# Altium project OPID[188] Backplane.PrjPcb
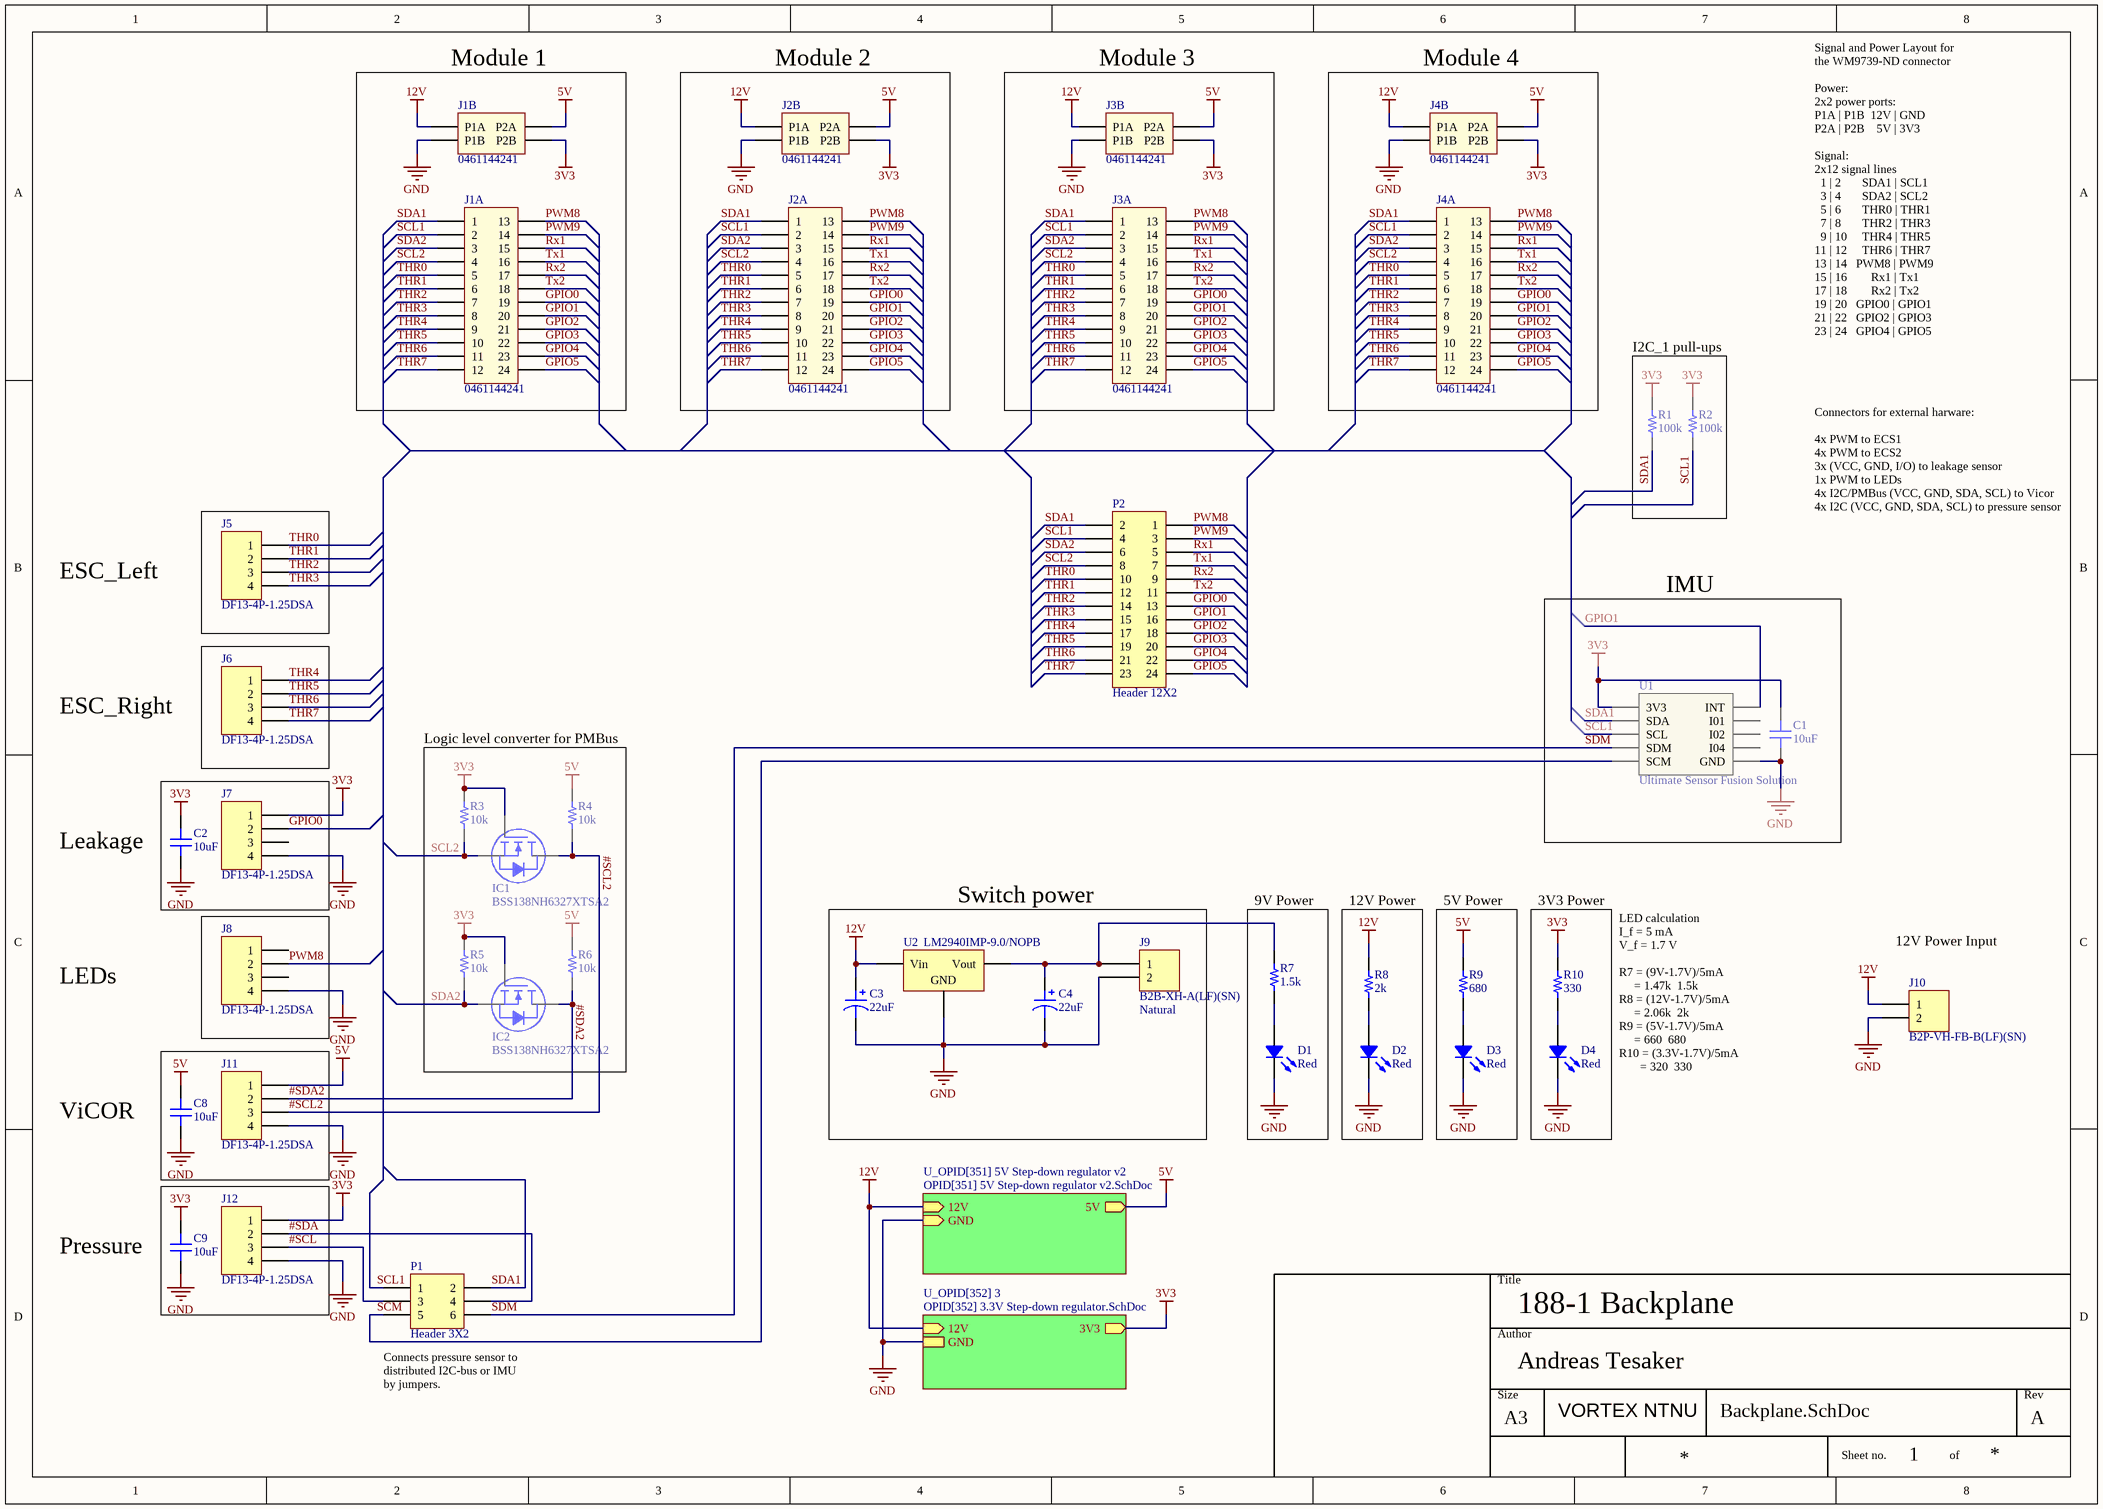
[diagram p0: Backplane.SchDoc]
3 sheets, 65 parts. Net scope: hierarchical (ports join the sheet entries above them; power ports are global).
Board file: Backplane_PCB_v2.PcbDoc
Sheets:
  Backplane.SchDoc
    U_OPID[352] 3 = OPID[352] 3.3V Step-down regulator.SchDoc
    U_OPID[351] 5V Step-down regulator v2 = OPID[351] 5V Step-down regulator v2.SchDoc

## Sheet Backplane.SchDoc: 188-1 Backplane
size A3; Author: Andreas Tesaker; CompanyName: VORTEX NTNU; Revision: A; SheetNumber: 1

### Parts
C1  10uF  [CAP 1210/3225 - 2.8MM]
C2  10uF  [CAP 1210/3225 - 2.8MM]
C3  22uF  [CAP ALUM 6.6MM]
C4  22uF  [CAP POL 2917/7343]
C8  10uF  [CAP 1210/3225 - 2.8MM]
C9  10uF  [CAP 1210/3225 - 2.8MM]
D1  Red  [LED 0805/2012 RED]
D2  Red  [LED 0805/2012 RED]
D3  Red  [LED 0805/2012 RED]
D4  Red  [LED 0805/2012 RED]
IC1  BSS138NH6327XTSA2  [INFINEON SOT-23-3]
IC2  BSS138NH6327XTSA2  [INFINEON SOT-23-3]
J1  0461144241  [LPH_VERT.RECEPT._ASSY_4PX24S]  (parts A,B of 2)
J2  0461144241  [LPH_VERT.RECEPT._ASSY_4PX24S]  (parts A,B of 2)
J3  0461144241  [LPH_VERT.RECEPT._ASSY_4PX24S]  (parts A,B of 2)
J4  0461144241  [LPH_VERT.RECEPT._ASSY_4PX24S]  (parts A,B of 2)
J5  DF13-4P-1.25DSA  [HDRV4W35P125_1X4_665X340X430P]
J6  DF13-4P-1.25DSA  [HDRV4W35P125_1X4_665X340X430P]
J7  DF13-4P-1.25DSA  [HDRV4W35P125_1X4_665X340X430P]
J8  DF13-4P-1.25DSA  [HDRV4W35P125_1X4_665X340X430P]
J9  B2B-XH-A(LF)(SN)  Colour: Natural  [JST XH B2B-XH-A]
J10  B2P-VH-FB-B(LF)(SN)  [B2P-VH-FB-B]
J11  DF13-4P-1.25DSA  [HDRV4W35P125_1X4_665X340X430P]
J12  DF13-4P-1.25DSA  [HDRV4W35P125_1X4_665X340X430P]
P1  Header 3X2  [HDR2X3]
P2  Header 12X2  [HDR2X12]
R1  100k  [RES 0805/2012]
R2  100k  [RES 0805/2012]
R3  10k  [RES 0805/2012]
R4  10k  [RES 0805/2012]
R5  10k  [RES 0805/2012]
R6  10k  [RES 0805/2012]
R7  1.5k  [RES 0805/2012]
R8  2k  [RES 0805/2012]
R9  680  [RES 0805/2012]
R10  330  [RES 0805/2012]
U1  Ultimate Sensor Fusion Solution  [Ultimate Sensor Fusion Solution]
U2  LM2940IMP-9.0/NOPB  [SOT230P700X180-4N]

### Blocks framed on the sheet
Module 1: J1
Module 2: J2
Module 3: J3
Module 4: J4
I2C_1 pull-ups: R1 R2
IMU: C1 U1
Logic level converter for PMBus: IC1 IC2 R3-R6
Switch power: C3 C4 J9 U2
9V Power: D1 R7
12V Power: D2 R8
5V Power: D3 R9
3V3 Power: D4 R10

### Sub-sheets
U_OPID[351] 5V Step-down regulator v2 = OPID[351] 5V Step-down regulator v2.SchDoc: 12V (in), GND (in), 5V (out)
U_OPID[352] 3 = OPID[352] 3.3V Step-down regulator.SchDoc: 12V (in), 3V3 (out), GND

### Nets
3V3: C1.2 C2.2 C9.2 IC1.1(G) IC2.1(G) J1.P2B J2.P2B J3.P2B J4.P2B J7.1 J12.1 R1.2 R2.2 R3.1 R5.1 R10.2 U1.2(3V3) ; sheet U_OPID[352] 3/3V3
5V: C8.2 J1.P2A J2.P2A J3.P2A J4.P2A J11.1 R4.1 R6.1 R9.2 ; sheet U_OPID[351] 5V Step-down regulator v2/5V
12V: C3.1 J1.P1A J2.P1A J3.P1A J4.P1A J10.1 R8.2 U2.1(Vin) ; sheet U_OPID[352] 3/12V, sheet U_OPID[351] 5V Step-down regulator v2/12V
GND: C1.1 C2.1 C3.2 C4.2 C8.1 C9.1 D1.2 D2.2 D3.2 D4.2 J1.P1B J2.P1B J3.P1B J4.P1B J7.4 J8.4 J9.2 J10.2 J11.4 J12.4 U1.1(GND) U2.2(GND) ; sheet U_OPID[352] 3/GND, sheet U_OPID[351] 5V Step-down regulator v2/GND
GPIO0: J1.19 J2.19 J3.19 J4.19 J7.2 P2.13
GPIO1: J1.20 J2.20 J3.20 J4.20 P2.16 U1.6(INT)
GPIO2: J1.21 J2.21 J3.21 J4.21 P2.18
GPIO3: J1.22 J2.22 J3.22 J4.22 P2.20
GPIO4: J1.23 J2.23 J3.23 J4.23 P2.22
GPIO5: J1.24 J2.24 J3.24 J4.24 P2.24
PWM8: J1.13 J2.13 J3.13 J4.13 J8.2 P2.1
PWM9: J1.14 J2.14 J3.14 J4.14 P2.3
Rx1: J1.15 J2.15 J3.15 J4.15 P2.5
Rx2: J1.17 J2.17 J3.17 J4.17 P2.9
SCL1: J1.2 J2.2 J3.2 J4.2 P1.1 P2.4 R2.1 U1.4(SCL)
SCL2: IC1.3(S) J1.4 J2.4 J3.4 J4.4 P2.8 R3.2
SDA1: J1.1 J2.1 J3.1 J4.1 P1.2 P2.2 R1.1 U1.5(SDA)
SDA2: IC2.3(S) J1.3 J2.3 J3.3 J4.3 P2.6 R5.2
THR0: J1.5 J2.5 J3.5 J4.5 J5.1 P2.10
THR1: J1.6 J2.6 J3.6 J4.6 J5.2 P2.12
THR2: J1.7 J2.7 J3.7 J4.7 J5.3 P2.14
THR3: J1.8 J2.8 J3.8 J4.8 J5.4 P2.15
THR4: J1.9 J2.9 J3.9 J4.9 J6.1 P2.17
THR5: J1.10 J2.10 J3.10 J4.10 J6.2 P2.19
THR6: J1.11 J2.11 J3.11 J4.11 J6.3 P2.21
THR7: J1.12 J2.12 J3.12 J4.12 J6.4 P2.23
Tx1: J1.16 J2.16 J3.16 J4.16 P2.7
Tx2: J1.18 J2.18 J3.18 J4.18 P2.11
NetC4_1: C4.1 J9.1 R7.2 U2.3(Vout)
NetD1_1: D1.1 R7.1
NetD2_1: D2.1 R8.1
NetD3_1: D3.1 R9.1
NetD4_1: D4.1 R10.1
NetIC1_2: IC1.2(D) J11.3 R4.2
NetIC2_2: IC2.2(D) J11.2 R6.2
NetJ12_2: J12.2 P1.4
NetJ12_3: J12.3 P1.3
NetP1_5: P1.5 U1.9(SCM)
NetP1_6: P1.6 U1.10(SDM)

Not connected (* = marked no-connect by the designer): J7 3; J8 1 3; U1 3(I02) 7(I04) 8(I01)

### Notes on the sheet
- Signal and Power Layout for
  the WM9739-ND connector
  Power:
  2x2 power ports:
  P1A | P1B  12V | GND
  P2A | P2B    5V | 3V3
  Signal:
  2x12 signal lines
  1 | 2       SDA1 | SCL1
  3 | 4       SDA2 | SCL2
  5 | 6       THR0 | THR1
  7 | 8       THR2 | THR3
  9 | 10     THR4 | THR5
  11 | 12     THR6 | THR7
  13 | 14   PWM8 | PWM9
  15 | 16        Rx1 | Tx1
  17 | 18        Rx2 | Tx2
  19 | 20   GPIO0 | GPIO1
  21 | 22   GPIO2 | GPIO3
  23 | 24   GPIO4 | GPIO5
- ESC_Left
- Connectors for external harware:
  4x PWM to ECS1
  4x PWM to ECS2
  3x (VCC, GND, I/O) to leakage sensor
  1x PWM to LEDs
  4x I2C/PMBus (VCC, GND, SDA, SCL) to Vicor
  4x I2C (VCC, GND, SDA, SCL) to pressure sensor
- ESC_Right
- (near U1) SDM
- (near C2) Leakage
- (near R4) #SCL2
- LEDs
- 12V Power Input
- #SDA2
- ViCOR
- (near J11) #SCL2
- (near J11) #SDA2
- LED calculation
  I_f = 5 mA
  V_f = 1.7 V
  R7 = (9V-1.7V)/5mA
  = 1.47k  1.5k
  R8 = (12V-1.7V)/5mA
  = 2.06k  2k
  R9 = (5V-1.7V)/5mA
  = 660  680
  R10 = (3.3V-1.7V)/5mA
  = 320  330
- (near C9) Pressure
- (near J12) #SDA
- (near J12) #SCL
- (near P1) SCM
- (near P1) SDM
- (near P1) Connects pressure sensor to distributed I2C-bus or IMU by jumpers.
- Title
- Size
- Author
- Rev
- A3
- Sheet no.
- of

### Library data of the parts
C1 C2 C8 C9 = C3225X7S1H106M250AB: CAP CER 10UF 50V X7S 1210; Manufacturer: TDK Corporation; TemperatureRange: -55C ~ 125C; Tolerance: 20%; Value: 10uF; Part Number: C3225X7S1H106M250AB; PartId: 19089; Supplier 1: Digi-Key; Supplier Part Number 1: 445-4537-2-ND; ComponentLink1Description: Datasheet; ComponentLink1URL: https://product.tdk.com/info/en/catalog/datasheets/mlcc_commercial_general_en.pdf; ComponentLink2Description: Digi-Key Listing; ComponentLink2URL: https://www.digikey.com/product-detail/en/tdk-corporation/C3225X7S1H106M250AB/445-4537-2-ND/2042208; TemperatureCoefficient: X7S; Voltage: 50V; Price: 0,3578; Device Package: 1210 (3225 Metric)
C3 = UWJ1V220MCL1GB: CAP ALUM 22UF 20% 35V SMD; Manufacturer: Nichicon; TemperatureRange: -40C ~ 85C; Type: General Purpose; Ripple Current: 45mA; Lifetime @ Temp: 2000 Hrs @ 85C; Value: 22uF; Part Number: UWJ1V220MCL1GB; PartId: 7192; Supplier 1: Digi-Key; Supplier Part Number 1: 493-9805-2-ND; ComponentLink1Description: Datasheet; ComponentLink1URL: http://nichicon-us.com/english/products/pdfs/e-wj.pdf; ComponentLink2Description: Digi-Key listing; ComponentLink2URL: http://digikey.com/product-detail/en/UWJ1V220MCL1GB/493-9805-2-ND/2550774; Tolerance: 20%; Voltage: 35V; Price: 0,1009; Device Package: Radial, Can - SMD; Impedance: -
C4 = 293D226X0020D2TE3: CAP TANT 22UF 20V 20% 2917; Manufacturer: Vishay Sprague; TemperatureRange: -55C ~ 125C; Type: General Purpose; Value: 22uF; Part Number: 293D226X0020D2TE3; PartId: 6865; Supplier 1: Digi-Key; Supplier Part Number 1: 718-1063-2-ND; ComponentLink1Description: Datasheet; ComponentLink1URL: http://www.vishay.com/docs/40002/293d.pdf; ComponentLink2Description: Digi-Key listing; ComponentLink2URL: http://digikey.com/product-detail/en/293D226X0020D2TE3/718-1063-2-ND/1559415; Tolerance: 20%; Voltage: 20V; Price: 0,3306; Device Package: 2917 (7343 Metric)
D1-D4 = LH R974-LP-1: LED RED DIFFUSED 0805 SMD; Manufacturer: OSRAM Opto Semiconductors Inc.; Value: Green; Type: Surface Mount; Millicandela: 41mcd; Voltage Forward: 1.8V; Current (Test): 20mA; Viewing Angle: 160; Part Number: LH R974-LP-1; PartId: 7077; Supplier 1: Digi-Key; Supplier Part Number 1: 475-1415-2-ND; ComponentLink1Description: Datasheet; ComponentLink1URL: http://www.osram-os.com/Graphics/XPic8/00078869_0.pdf; ComponentLink2Description: Digi-Key Listing; ComponentLink2URL: http://www.digikey.ca/product-detail/en/LH%20R974-LP-1/475-1415-2-ND/1227932; Price: 0,0621; Device Package: 0805 (2012 Metric); Colour: Red; Lens Transparency: Diffused
IC1 IC2 = BSS138NH6327XTSA2: MOSFET N-CH 60V 230MA SOT-23; Manufacturer: Infineon Technologies; Rds On (Max) at Id, Vgs: 3.5 Ohm @ 230mA, 10V; Vgs(th) (Max) at Id: 20V; Gate Charge (Qg): 1.4nC @ 10V; Input Capacitance (Ciss) at Vds: 41pF @ 25V; Current Continuous Drain: 230mA (Ta); Part Number: BSS138NH6327XTSA2; PartId: 29472; Supplier 1: Digi-Key; Supplier Part Number 1: BSS138NH6327XTSA2CT-ND; ComponentLink1Description: Datasheet; ComponentLink1URL: http://www.infineon.com/dgdl/Infineon-BSS138N-DS-v02_86-en.pdf?fileId=db3a304330f68606013104d944d53efb; ComponentLink2Description: Digi-Key Listing; ComponentLink2URL: https://www.digikey.com/product-detail/en/infineon-technologies/BSS138NH6327XTSA2/BSS138NH6327XTSA2CT-ND/5413728; Price: 0,34; Type: N-Channel; Device Package: TO-236-3, SC-59, SOT-23-3; Drain to Source Voltage (Vdss): 60V
J1-J4 = 0461144241: Number Of Positions: 28; Part Number: 0461144241; ComponentLink1Description: Manufacturer Link; ComponentLink1URL: http://www.molex.com/; ComponentLink2Description: Datasheet; ComponentLink2URL: http://www.molex.com/pdm_docs/sd/461144241_sd.pdf; Supplier 1: Digi-Key; Supplier Part Number 1: WM9739-ND; Number Of Rows: 2; Mounting Type: Through Hole
J5-J8 J11 J12 = DF13-4P-1.25DSA: Number Of Positions: 4; Part Number: DF13-4P-1.25DSA; ComponentLink1Description: Manufacturer Link; ComponentLink1URL: https://www.hirose.com/; ComponentLink2Description: Datasheet; ComponentLink2URL: https://www.hirose.com/product/en/download_file/key_name/DF13/category/Catalog/doc_file_id/31687/?file_category_id=4&item_id=38&is_series=1; Supplier 1: Digi-Key; Supplier Part Number 1: H2193-ND; Number Of Rows: 1; Mounting Type: Through Hole
J9 = B2B-XH-A(LF)(SN): CONN HEADER XH TOP 2POS 2.5MM; Manufacturer: JST Sales America Inc.; Pitch: 0.098" (2.50mm); Number Of Positions: 2; Part Number: B2B-XH-A(LF)(SN); PartId: 16449; Supplier 1: Digi-Key; Supplier Part Number 1: 455-2247-ND; ComponentLink1Description: Datasheet; ComponentLink1URL: http://www.jst-mfg.com/product/pdf/eng/eXH.pdf; ComponentLink2Description: Digi-Key Listing; ComponentLink2URL: http://www.digikey.com/product-detail/en/jst-sales-america-inc/B2B-XH-A(LF)(SN)/455-2247-ND/1651045; Price: 0,15; Type: Header, Shrouded; Contact Finish: Tin; Fastening Type: Detent Lock; Number Of Rows: 1; Series: XH
J10 = B2P-VH-FB-B(LF)(SN): Number Of Positions: 2; Part Number: B2P-VH-FB-B(LF)(SN); ComponentLink1Description: Manufacturer Link; ComponentLink1URL: http://www.jst.com; ComponentLink2Description: Datasheet; ComponentLink2URL: http://www.jst-mfg.com/product/pdf/eng/eVH.pdf; Supplier 1: Digi-Key; Supplier Part Number 1: 455-2947-ND; Number Of Rows: 1
P1 = Header 3X2: Header, 3-Pin, Dual row; LatestRevisionDate: 17-Jul-2002; LatestRevisionNote: Re-released for DXP Platform.; Publisher: Altium Limited
P2 = Header 12X2: Header, 12-Pin, Dual row; LatestRevisionDate: 17-Jul-2002; LatestRevisionNote: Re-released for DXP Platform.; Publisher: Altium Limited
R1 R2 = ERJ-6ENF1003V: RES SMD 100K OHM 1% 1/8W 0805; Manufacturer: Panasonic Electronic Components; TemperatureRange: -55C ~ 155C; TemperatureCoefficient: 100ppm/C; PowerRating: 0.125W, 1/8W; Value: 100k; Part Number: ERJ-6ENF1003V; PartId: 1950; Supplier 1: Digi-Key; Supplier Part Number 1: P100KCTR-ND; ComponentLink1Description: Datasheet; ComponentLink1URL: http://industrial.panasonic.com/www-cgi/jvcr13pz.cgi?E+PZ+3+AOA0002+ERJ6ENF1003V+7+WW; ComponentLink2Description: Digi-Key listing; ComponentLink2URL: http://digikey.com/product-detail/en/ERJ-6ENF1003V/P100KCTR-ND/111841; Tolerance: 1%; Price: 0,0073; Type: Thick Film; Device Package: 0805 (2012 Metric)
R3-R6 = ERJ-6ENF1002V: RES SMD 10K OHM 1% 1/8W 0805; Manufacturer: Panasonic Electronic Components; TemperatureRange: -55C ~ 155C; TemperatureCoefficient: 100ppm/C; PowerRating: 0.125W, 1/8W; Value: 10k; Part Number: ERJ-6ENF1002V; PartId: 1947; Supplier 1: Digi-Key; Supplier Part Number 1: P10.0KCTR-ND; ComponentLink1Description: Datasheet; ComponentLink1URL: http://industrial.panasonic.com/www-cgi/jvcr13pz.cgi?E+PZ+3+AOA0002+ERJ6ENF1002V+7+WW; ComponentLink2Description: Digi-Key listing; ComponentLink2URL: http://digikey.com/product-detail/en/ERJ-6ENF1002V/P10.0KCTR-ND/111474; Tolerance: 1%; Price: 0,0073; Type: Thick Film; Device Package: 0805 (2012 Metric)
R7 = ERA-6AEB152V: RES SMD 1.5K OHM 0.1% 1/8W 0805; Manufacturer: Panasonic Electronic Components; TemperatureRange: -55C ~ 155C; TemperatureCoefficient: 25ppm/C; PowerRating: 0.125W, 1/8W; Value: 1.5k; Part Number: ERA-6AEB152V; PartId: 2578; Supplier 1: Digi-Key; Supplier Part Number 1: P1.5KDATR-ND; ComponentLink1Description: Datasheet; ComponentLink1URL: http://industrial.panasonic.com/lecs/www-data/pdf/AOA0000/AOA0000CE26.pdf; ComponentLink2Description: Digi-Key listing; ComponentLink2URL: http://digikey.com/product-detail/en/ERA-6AEB152V/P1.5KDATR-ND/1465753; Tolerance: 0.1%; Price: 0,0653; Device Package: 0805 (2012 Metric); Type: Thin Film
R8 = ERA-6AEB202V: RES SMD 2K OHM 0.1% 1/8W 0805; Manufacturer: Panasonic Electronic Components; TemperatureRange: -55C ~ 155C; TemperatureCoefficient: 25ppm/C; PowerRating: 0.125W, 1/8W; Value: 2k; Part Number: ERA-6AEB202V; PartId: 2444; Supplier 1: Digi-Key; Supplier Part Number 1: P2.0KDATR-ND; ComponentLink1Description: Datasheet; ComponentLink1URL: http://industrial.panasonic.com/lecs/www-data/pdf/AOA0000/AOA0000CE26.pdf; ComponentLink2Description: Digi-Key listing; ComponentLink2URL: http://digikey.com/product-detail/en/ERA-6AEB202V/P2.0KDATR-ND/1465756; Tolerance: 0.1%; Price: 0,055; Type: Thin Film; Device Package: 0805 (2012 Metric)
R9 = ERJ-6ENF6800V: RES SMD 680 OHM 1% 1/8W 0805; Manufacturer: Panasonic Electronic Components; TemperatureRange: -55C ~ 155C; TemperatureCoefficient: 100ppm/C; PowerRating: 0.125W, 1/8W; Value: 680; Part Number: ERJ-6ENF6800V; PartId: 2226; Supplier 1: Digi-Key; Supplier Part Number 1: P680CTR-ND; ComponentLink1Description: Datasheet; ComponentLink1URL: http://industrial.panasonic.com/www-cgi/jvcr13pz.cgi?E+PZ+3+AOA0002+ERJ6ENF6800V+7+WW; ComponentLink2Description: Digi-Key listing; ComponentLink2URL: http://digikey.com/product-detail/en/ERJ-6ENF6800V/P680CTR-ND/1746526; Tolerance: 1%; Price: 0,0073; Type: Thick Film; Device Package: 0805 (2012 Metric)
R10 = ERJ-P06J331V: RES SMD 330 OHM 5% 1/2W 0805; Manufacturer: Panasonic Electronic Components; TemperatureRange: -55C ~ 155C; TemperatureCoefficient: 200ppm/C; PowerRating: 0.5W, 1/2W; Value: 330; Part Number: ERJ-P06J331V; PartId: 11579; Supplier 1: Digi-Key; Supplier Part Number 1: P330ADTR-ND; ComponentLink1Description: Datasheet; ComponentLink1URL: //media.digikey.com/pdf/Data%20Sheets/Panasonic%20Electronic%20Components/ERJ_PA2_P03_PA3_P06_P08_P14.pdf; ComponentLink2Description: Digi-Key Listing; ComponentLink2URL: https://www.digikey.com/product-detail/en/panasonic-electronic-components/ERJ-P06J331V/P330ADTR-ND/525256; Tolerance: 5%; Price: 0,0129; Device Package: 0805 (2012 Metric)
U2 = LM2940IMP-9.0/NOPB: Vin,min: 10V; Vin,max: 26V; Vout,nom: 9V; Iout,max: 1A; Part Number: LM2940IMP-9.0/NOPB; ComponentLink1Description: Manufacturer Link; ComponentLink1URL: http://www.ti.com; ComponentLink2Description: Datasheet; ComponentLink2URL: http://www.ti.com/lit/ds/symlink/lm2940-n.pdf; Supplier 1: Digi-Key; Supplier Part Number 1: LM2940IMP-9.0/NOPBCT-ND
U1 = Ultimate Sensor Fusion Solution: Part Number: Ultimate Sensor Fusion Solution; ComponentLink1Description: Manufacturer Link; ComponentLink1URL: https://www.tindie.com/products/onehorse/ultimate-sensor-fusion-solution/; ComponentLink2Description: Datasheet; ComponentLink2URL: https://github.com/kriswiner/EM7180_SENtral_sensor_hub/wiki

## Sheet OPID[352] 3.3V Step-down regulator.SchDoc: 3.3V Step-down regulator
size A4; Author: Andreas Tesaker; CompanyName: VORTEX NTNU; Revision: A; SheetNumber: 3
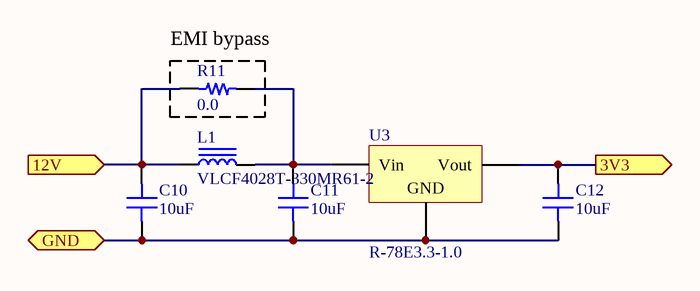
[diagram p1: OPID[352] 3.3V Step-down regulator.SchDoc]

### Parts
C10  10uF  [CAP 1210/3225 - 2.8MM]
C11  10uF  [CAP 1210/3225 - 2.8MM]
C12  10uF  [CAP 1210/3225 - 2.8MM]
L1  VLCF4028T-330MR61-2  [TDK VLCF4028-2]
R11  0.0  [RES 0805/2012]
U3  R-78E3.3-1.0  [R-78Exx-1.0]

### Ports
3V3 (out), 12V (in), GND

### Nets
3V3: C12.2 U3.3(Vout) ; port 3V3
12V: C10.2 L1.1 R11.1 ; port 12V
GND: C10.1 C11.1 C12.1 U3.2(GND) ; port GND
NetC11_2: C11.2 L1.2 R11.2 U3.1(Vin)

### Notes on the sheet
- (near R11) EMI bypass
- Title
- Size
- Author
- Rev
- A4
- Sheet no.
- of

### Library data of the parts
C10-C12 = C3225X7S1H106M250AB: as C1 on sheet Backplane; Value: 10uF; Part Number: C3225X7S1H106M250AB; PartId: 19089; Supplier 1: Digi-Key; Supplier Part Number 1: 445-4537-2-ND; ComponentLink1Description: Datasheet; ComponentLink1URL: https://product.tdk.com/info/en/catalog/datasheets/mlcc_commercial_general_en.pdf; ComponentLink2Description: Digi-Key Listing; ComponentLink2URL: https://www.digikey.com/product-detail/en/tdk-corporation/C3225X7S1H106M250AB/445-4537-2-ND/2042208; TemperatureCoefficient: X7S; Voltage: 50V; Price: 0,3578; Device Package: 1210 (3225 Metric)
L1 = VLCF4028T-330MR61-2: FIXED IND 33UH 610MA 350 MOHM; Manufacturer: TDK Corporation; Type: Wirewound; Material - Core: Ferrite; Tolerance: 20%; Shielding: Shielded; DC Resistance (DCR): 350 mOhm Max; Value: 33uH; Part Number: VLCF4028T-330MR61-2; PartId: 16423; Supplier 1: Digi-Key; Supplier Part Number 1: 445-6549-2-ND; ComponentLink1Description: Datasheet; ComponentLink1URL: https://product.tdk.com/info/en/catalog/datasheets/inductor_commercial_power_vlcf4028-2_en.pdf; ComponentLink2Description: Digi-Key Listing; ComponentLink2URL: https://www.digikey.com/product-detail/en/tdk-corporation/VLCF4028T-330MR61-2/445-6549-2-ND/2465306; Price: 0,441; Device Package: Nonstandard; Series: VLCF; Inductance: 33uH; Current Rating: 610mA; Current - Saturation: 610mA; Operating Temperature: -40C ~ 105C
R11 = 5106: RES SMD 0.0 OHM JUMPER 1/2W 0805; Part Number: 5106; Manufacturer: Keystone Electronics; PowerRating: 0.5W, 1/2W; Value: 0.0; PartId: 16148; Supplier 1: Digi-Key; Supplier Part Number 1: 36-5106TR-ND; ComponentLink1Description: Datasheet; ComponentLink1URL: http://www.keyelco.com/product-pdf.cfm?p=14039; ComponentLink2Description: Digi-Key Listing; ComponentLink2URL: https://www.digikey.com/product-detail/en/keystone-electronics/5106/36-5106TR-ND/5118868; Tolerance: Jumper; Price: 0,2505; Device Package: 0805 (2012 Metric)
U3 = R-78E3.3-1.0: Vin,min: 7V; Vin,max: 28V; Vout,nom: 3.3V; Iout,max: 1A; Part Number: R-78E3.3-1.0; ComponentLink1Description: Manufacturer Link; ComponentLink1URL: https://www.recom-power.com/; ComponentLink2Description: Datasheet; ComponentLink2URL: https://www.recom-power.com/pdf/Innoline/R-78Exx-1.0.pdf; Supplier 1: Digi-Key; Supplier Part Number 1: 945-2409-5-ND

## Sheet OPID[351] 5V Step-down regulator v2.SchDoc
size A3; Author: Andreas Tesaker; CompanyName: VORTEX NTNU; Revision: A
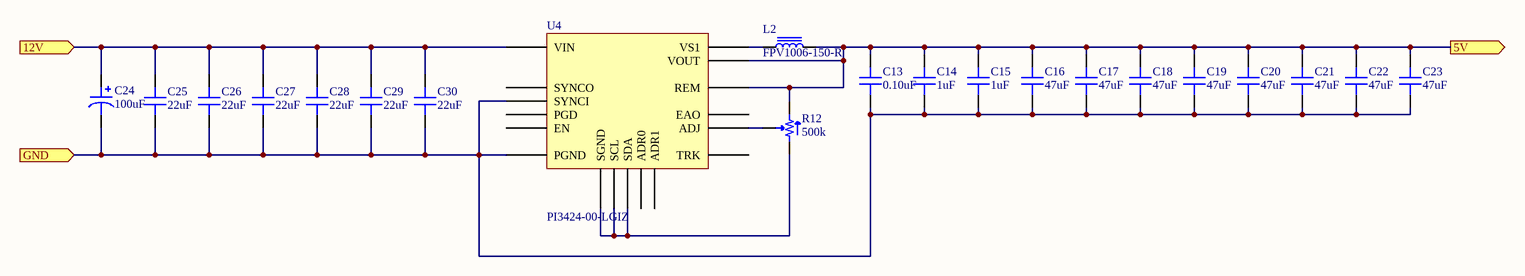
[diagram p2: OPID[351] 5V Step-down regulator v2.SchDoc]

### Parts
C13  0.10uF  [CAP 1206/3216 - 1.0MM]
C14  1uF  [CAP 0603/1608]
C15  1uF  [CAP 0603/1608]
C16  47uF  [CAP 1206/3216]
C17  47uF  [CAP 1206/3216]
C18  47uF  [CAP 1206/3216]
C19  47uF  [CAP 1206/3216]
C20  47uF  [CAP 1206/3216]
C21  47uF  [CAP 1206/3216]
C22  47uF  [CAP 1206/3216]
C23  47uF  [CAP 1206/3216]
C24  100uF  [CAP ALUM 10.3MM]
C25  22uF  [CAP 1206/3216]
C26  22uF  [CAP 1206/3216]
C27  22uF  [CAP 1206/3216]
C28  22uF  [CAP 1206/3216]
C29  22uF  [CAP 1206/3216]
C30  22uF  [CAP 1206/3216]
L2  FPV1006-150-R  [FPV1006-150-R]
R12  500k  [POT Panasonic EVM]
U4  PI3424-00-LGIZ  [PI34xx-00]

### Ports
5V (out), 12V (in), GND (in)

### Nets
5V: C13.2 C14.2 C15.2 C16.2 C17.2 C18.2 C19.2 C20.2 C21.2 C22.2 C23.2 L2.2 R12.3 U4.REM U4.VOUT ; port 5V
12V: C24.1 C25.2 C26.2 C27.2 C28.2 C29.2 C30.2 U4.VIN ; port 12V
GND: C13.1 C14.1 C15.1 C16.1 C17.1 C18.1 C19.1 C20.1 C21.1 C22.1 C23.1 C24.2 C25.1 C26.1 C27.1 C28.1 C29.1 C30.1 U4.PGND U4.SYNCI ; port GND
NetL2_1: L2.1 U4.VS1
NetR12_1: R12.1 U4.SCL U4.SDA U4.SGND
NetR12_2: R12.2 U4.ADJ

Not connected (* = marked no-connect by the designer): U4 ADR0 ADR1 EAO EN PGD SYNCO TRK

### Notes on the sheet
- Title
- Size
- Author
- Rev
- A3
- Sheet no.
- of

### Library data of the parts
C13 = GRM319R71H104KA01D: CAP CER 0.1UF 50V X7R 1206; Manufacturer: Murata Electronics North America; TemperatureRange: -55C ~ 125C; Tolerance: 10%; Value: 0.10uF; Part Number: GRM319R71H104KA01D; PartId: 16942; Supplier 1: Digi-Key; Supplier Part Number 1: 490-1775-2-ND; ComponentLink1Description: Datasheet; ComponentLink1URL: http://www.murata.com/~/media/webrenewal/support/library/catalog/products/capacitor/mlcc/c02e.pdf; ComponentLink2Description: Digi-Key Listing; ComponentLink2URL: https://www.digikey.com/product-detail/en/murata-electronics-north-america/GRM319R71H104KA01D/490-1775-2-ND/586815; TemperatureCoefficient: X7R; Voltage: 50V; Price: 0,0231; Device Package: 1206 (3216 Metric)
C14 C15 = GRM188R71C105KA12D: CAP CER 1UF 16V X7R 0603; Manufacturer: Murata Electronics North America; TemperatureRange: -55C ~ 125C; Tolerance: 10%; Value: 1uF; Part Number: GRM188R71C105KA12D; PartId: 12965; Supplier 1: Digi-Key; Supplier Part Number 1: 490-3900-2-ND; ComponentLink1Description: Datasheet; ComponentLink1URL: http://www.murata.com/~/media/webrenewal/support/library/catalog/products/capacitor/mlcc/c02e.pdf; ComponentLink2Description: Digi-Key Listing; ComponentLink2URL: https://www.digikey.com/product-detail/en/murata-electronics-north-america/GRM188R71C105KA12D/490-3900-2-ND/965914; TemperatureCoefficient: X7R; Voltage: 16V; Price: 0,014; Device Package: 0603 (1608 Metric)
C16-C23 = GRM31CR61A476ME15L: CAP CER 47UF 10V X5R 1206; Manufacturer: Murata Electronics North America; TemperatureRange: -55C ~ 85C; Tolerance: 20%; Value: 47uF; Part Number: GRM31CR61A476ME15L; PartId: 15800; Supplier 1: Digi-Key; Supplier Part Number 1: 490-5528-2-ND; ComponentLink1Description: Datasheet; ComponentLink1URL: http://www.murata.com/~/media/webrenewal/support/library/catalog/products/capacitor/mlcc/c02e.pdf; ComponentLink2Description: Digi-Key Listing; ComponentLink2URL: https://www.digikey.com/product-detail/en/murata-electronics-north-america/GRM31CR61A476ME15L/490-5528-2-ND/2334879; TemperatureCoefficient: X5R; Voltage: 10V; Price: 0,2053; Device Package: 1206 (3216 Metric)
C24 = UUX1H101MNL1GS: CAP ALUM 100UF 20% 50V SMD; Manufacturer: Nichicon; TemperatureRange: -55C ~ 105C; Type: General Purpose; Ripple Current: 310mA; Lifetime @ Temp: 2000 Hrs @ 105C; Value: 100uF; Part Number: UUX1H101MNL1GS; PartId: 7391; Supplier 1: Digi-Key; Supplier Part Number 1: 493-6269-2-ND; ComponentLink1Description: Datasheet; ComponentLink1URL: http://nichicon-us.com/english/products/pdfs/e-ux.pdf; ComponentLink2Description: Digi-Key listing; ComponentLink2URL: http://digikey.com/product-detail/en/UUX1H101MNL1GS/493-6269-2-ND/2550537; Tolerance: 20%; Voltage: 50V; Price: 0,2791; Device Package: Radial, Can - SMD; Impedance: -
C25-C30 = GRM31CR61E226KE15L: CAP CER 22UF 25V X5R 1206; Manufacturer: Murata Electronics North America; TemperatureRange: -55C ~ 85C; Tolerance: 10%; Value: 22uF; Part Number: GRM31CR61E226KE15L; PartId: 15793; Supplier 1: Digi-Key; Supplier Part Number 1: 490-5527-2-ND; ComponentLink1Description: Datasheet; ComponentLink1URL: http://www.murata.com/~/media/webrenewal/support/library/catalog/products/capacitor/mlcc/c02e.pdf; ComponentLink2Description: Digi-Key Listing; ComponentLink2URL: https://www.digikey.com/product-detail/en/murata-electronics-north-america/GRM31CR61E226KE15L/490-5527-2-ND/2334878; TemperatureCoefficient: X5R; Voltage: 25V; Price: 0,1785; Device Package: 1206 (3216 Metric)
L2 = FPV1006-150-R: FIXED IND 150NH 25A 0.41 MOHM; Irms: 25; Part Number: FPV1006-150-R; Value: 150nH; ComponentLink1Description: Manufacturer Link; ComponentLink1URL: http://www.eaton.no/EatonNO/index.htm; ComponentLink2Description: Datasheet; ComponentLink2URL: http://www.cooperindustries.com/content/dam/public/bussmann/Electronics/Resources/product-datasheets/bus-elx-ds-10390-fpv1006.pdf; Supplier 1: Digi-Key; Supplier Part Number 1: 283-4578-2-ND
R12 = EVM-3YSX50B55: TRIMMER 500K OHM 0.15W SMD; Manufacturer: Panasonic Electronic Components; TemperatureCoefficient: 250ppm/C; Tolerance: 25%; Number Of Turns: Single; Adjustment Type: Top Adjustment; Value: 500k; Part Number: EVM-3YSX50B55; PartId: 7181; Supplier 1: Digi-Key; Supplier Part Number 1: P3Y504TR-ND; ComponentLink1Description: Datasheet; ComponentLink1URL: http://media.digikey.com/pdf/Data%20Sheets/Panasonic%20Resistors%20Thermistors%20PDFs/EVM-3Y_S_R_Rev2010.pdf; ComponentLink2Description: Digi-Key Listing; ComponentLink2URL: http://www.digikey.ca/product-detail/en/EVM-3YSX50B55/P3Y504TR-ND/259783; PowerRating: 0.15W; Price: 0,2543; Type: Surface Mount
U4 = PI3424-00-LGIZ: Vin,min: 8V; Vin,max: 18V; Vout,nom: 5V; Iout,max: 15A; Part Number: PI3424-00-LGIZ; ComponentLink1Description: Manufacturer Link; ComponentLink1URL: http://www.vicorpower.com/; ComponentLink2Description: Datasheet; ComponentLink2URL: http://vicorpower.com/documents/datasheets/Picor/ds_pi34xx-00.pdf; Supplier 1: Digi-Key; Supplier Part Number 1: 1102-1641-ND

## Nets that join several sheets
3V3: Backplane (17 pins), OPID[352] 3.3V Step-down regulator (C12.2 U3.3)
5V: Backplane (9 pins), OPID[351] 5V Step-down regulator v2 (15 pins)
12V: Backplane (8 pins), OPID[352] 3.3V Step-down regulator (C10.2 L1.1 R11.1), OPID[351] 5V Step-down regulator v2 (8 pins)
GND: Backplane (22 pins), OPID[352] 3.3V Step-down regulator (C10.1 C11.1 C12.1 U3.2), OPID[351] 5V Step-down regulator v2 (20 pins)